# Altium schematic sheet Passive Filters.SchDoc
size A
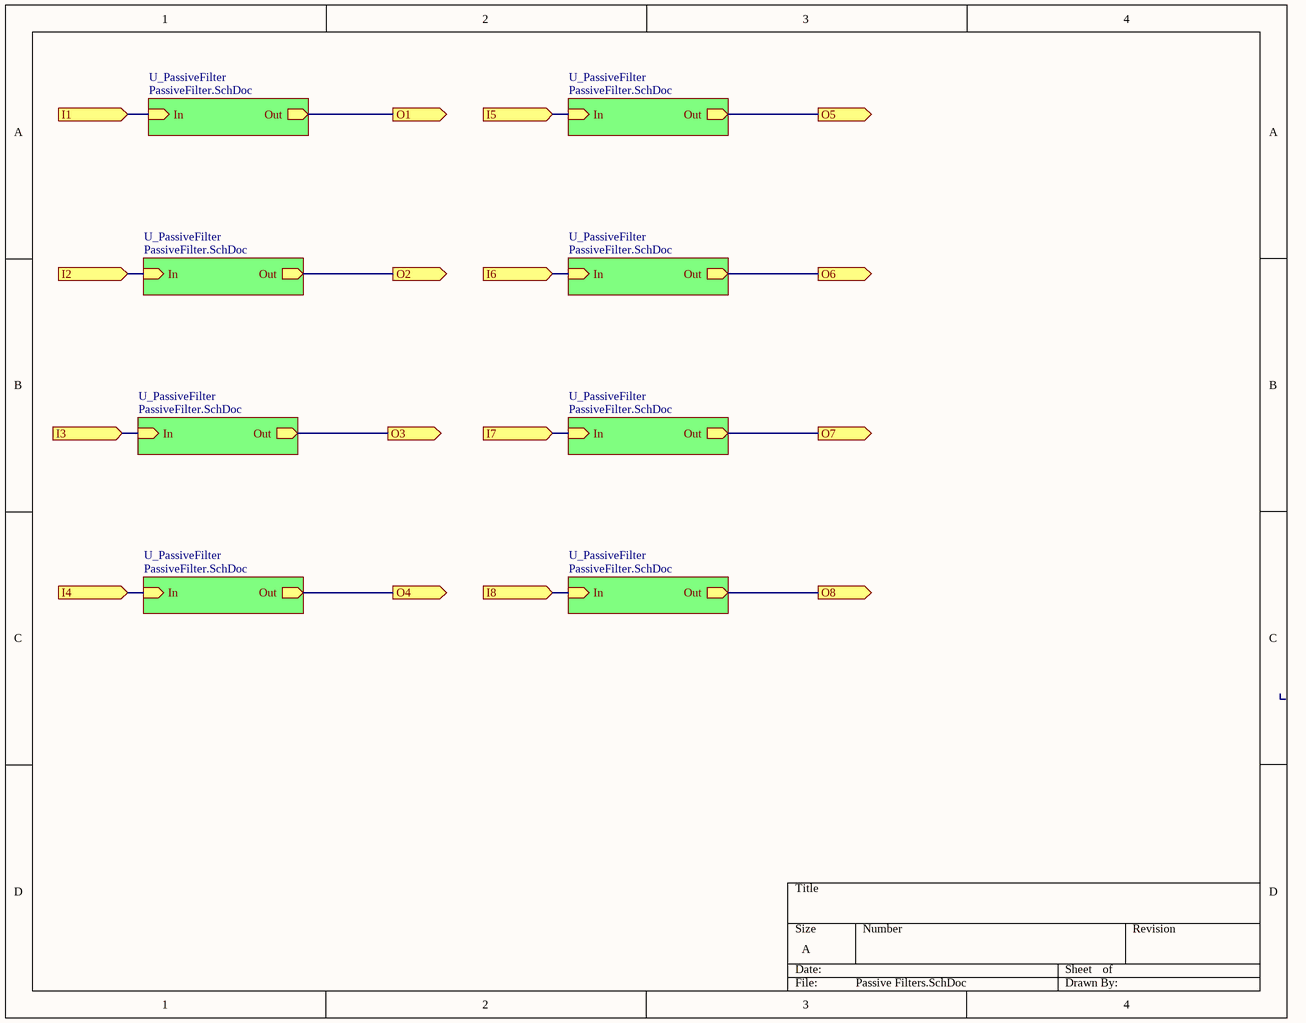
[diagram p0: Passive Filters.SchDoc]

## Sub-sheets
U_PassiveFilter = PassiveFilter.SchDoc: In (in), Out (out)
U_PassiveFilter = PassiveFilter.SchDoc: In (in), Out (out)
U_PassiveFilter = PassiveFilter.SchDoc: In (in), Out (out)
U_PassiveFilter = PassiveFilter.SchDoc: In (in), Out (out)
U_PassiveFilter = PassiveFilter.SchDoc: In (in), Out (out)
U_PassiveFilter = PassiveFilter.SchDoc: In (in), Out (out)
U_PassiveFilter = PassiveFilter.SchDoc: In (in), Out (out)
U_PassiveFilter = PassiveFilter.SchDoc: In (in), Out (out)

## Ports
I1 (in), I2 (in), I3 (in), I4 (in), I5 (in), I6 (in), I7 (in), I8 (in), O1 (out), O2 (out), O3 (out), O4 (out), O5 (out), O6 (out), O7 (out), O8 (out)

## Nets
I1: port I1, sheet U_PassiveFilter/In
I2: port I2, sheet U_PassiveFilter/In
I3: port I3, sheet U_PassiveFilter/In
I4: port I4, sheet U_PassiveFilter/In
I5: port I5, sheet U_PassiveFilter/In
I6: port I6, sheet U_PassiveFilter/In
I7: port I7, sheet U_PassiveFilter/In
I8: port I8, sheet U_PassiveFilter/In
O1: port O1, sheet U_PassiveFilter/Out
O2: port O2, sheet U_PassiveFilter/Out
O3: port O3, sheet U_PassiveFilter/Out
O4: port O4, sheet U_PassiveFilter/Out
O5: port O5, sheet U_PassiveFilter/Out
O6: port O6, sheet U_PassiveFilter/Out
O7: port O7, sheet U_PassiveFilter/Out
O8: port O8, sheet U_PassiveFilter/Out